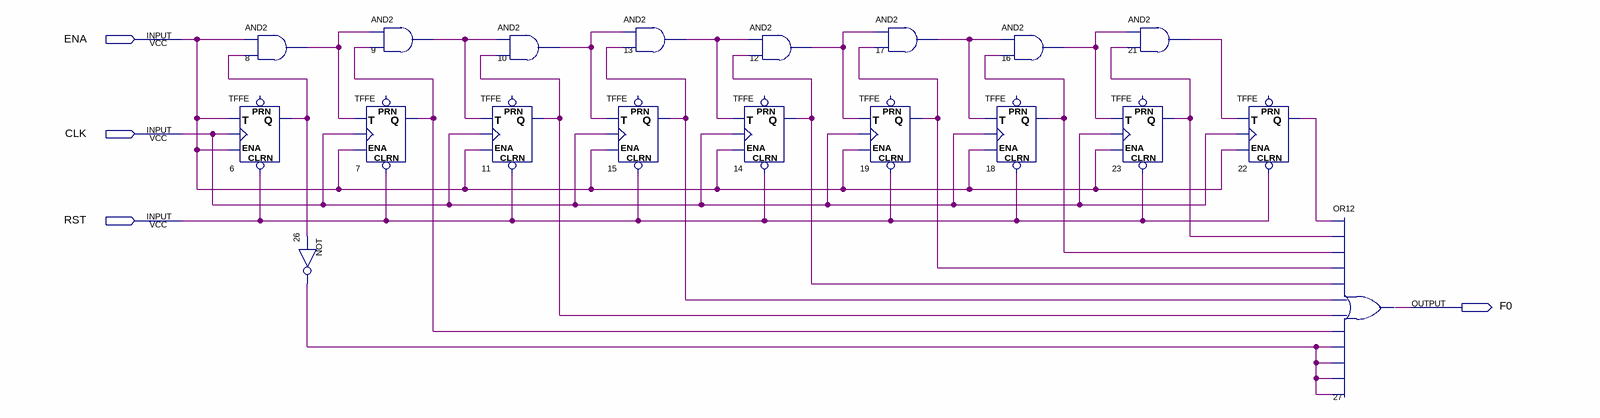
[diagram p0: schematic sheet]
// Quartus schematic f0_former.bdf as structural Verilog: 19 symbols, 4 pins
module f0_former (
  input  ENA,
  input  CLK,
  input  RST,
  output F0
);

  wire n6_q, n7_q, n8_out, n9_out, n10_out, n11_q, n12_out, n13_out, n14_q, n15_q, n16_out, n17_out, n18_q,
       n19_q, n21_out, n22_q, n23_q, n26_out;

  TFFE u_6 (.CLRN(RST), .T(ENA), .CLK(CLK), .ENA(ENA), .Q(n6_q));  // open: PRN
  and u_8 (n8_out, ENA, n6_q);
  not u_26 (n26_out, n6_q);
  TFFE u_7 (.CLRN(RST), .T(n8_out), .CLK(CLK), .ENA(ENA), .Q(n7_q));  // open: PRN
  and u_9 (n9_out, n8_out, n7_q);
  TFFE u_11 (.CLRN(RST), .T(n9_out), .CLK(CLK), .ENA(ENA), .Q(n11_q));  // open: PRN
  and u_10 (n10_out, n9_out, n11_q);
  TFFE u_15 (.CLRN(RST), .T(n10_out), .CLK(CLK), .ENA(ENA), .Q(n15_q));  // open: PRN
  and u_13 (n13_out, n10_out, n15_q);
  TFFE u_14 (.CLRN(RST), .T(n13_out), .CLK(CLK), .ENA(ENA), .Q(n14_q));  // open: PRN
  and u_12 (n12_out, n13_out, n14_q);
  TFFE u_19 (.CLRN(RST), .T(n12_out), .CLK(CLK), .ENA(ENA), .Q(n19_q));  // open: PRN
  and u_17 (n17_out, n12_out, n19_q);
  TFFE u_18 (.CLRN(RST), .T(n17_out), .CLK(CLK), .ENA(ENA), .Q(n18_q));  // open: PRN
  and u_16 (n16_out, n17_out, n18_q);
  TFFE u_23 (.CLRN(RST), .T(n16_out), .CLK(CLK), .ENA(ENA), .Q(n23_q));  // open: PRN
  and u_21 (n21_out, n16_out, n23_q);
  TFFE u_22 (.CLRN(RST), .T(n21_out), .CLK(CLK), .ENA(ENA), .Q(n22_q));  // open: PRN
  or u_27 (F0, n22_q, n23_q, n18_q, n19_q, n14_q, n15_q, n11_q, n7_q, n26_out, n26_out, n26_out, n26_out);
endmodule
